# EAGLE design RHD2164-L-SS4-AmpAccel (EAGLE 9.3.2)

## Sheet 1 of 2: Vertical
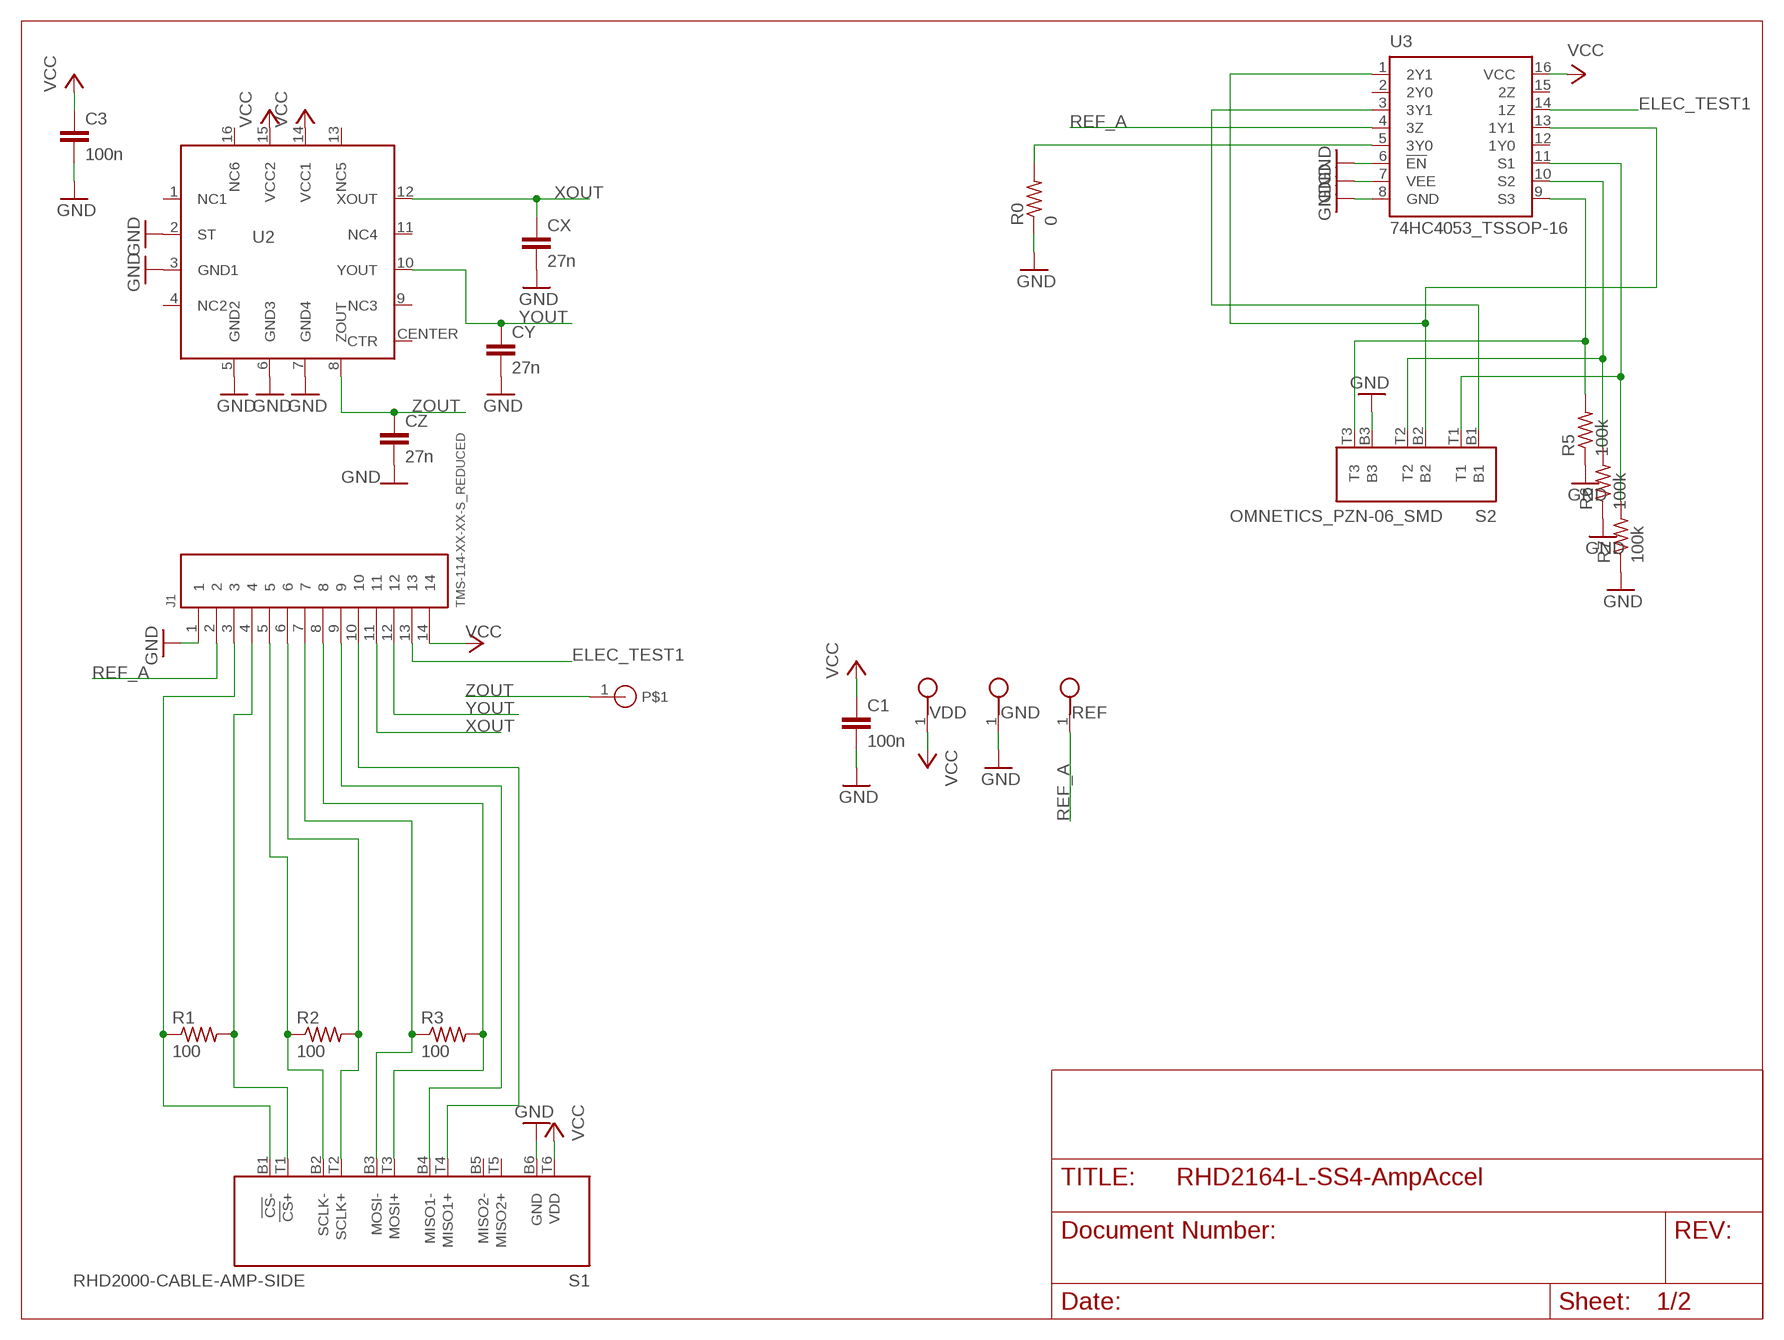
[diagram p0: schematic, sheet 1]

### Parts
C1  100n  C_0402  [0402]
C3  100n  C_0402  [0402]
CX  27n  C_0402  [0402]
CY  27n  C_0402  [0402]
CZ  27n  C_0402  [0402]
GND  TESTPOINT_SMALL  [TESTPOINT_SMALL]
J1  TMS-114-XX-XX-S_REDUCED  [TMS-114-XX-XX-S_REDUCED]
R0  0  R_0402  [0402]
R1  100  R_0201  [0201]
R2  100  R_0201  [0201]
R3  100  R_0201  [0201]
R5  100k  R_0201  [0201]
R6  100k  R_0201  [0201]
R7  100k  R_0201  [0201]
REF  TESTPOINT_SMALL  [TESTPOINT_SMALL]
S1  RHD2000-CABLE-AMP-SIDE  [OMNETICS_PZN-12-AA]
S2  OMNETICS_PZN-06_SMD  [OMNETICS_PZN-06-AA]
U2  ADXL335_IDAX  [ADXL335_IDAX]
U3  74HC4053_TSSOP-16  [TSSOP-16]
U$1  PIN_HOLE  [PIN_HOLE]
VDD  TESTPOINT_SMALL  [TESTPOINT_SMALL]

### Nets
CS-: J1.3 R1.1 S1.B1(!CS!-)
ELEC_TEST1: J1.13 U3.14(1Z)
GND [thick]: C1.2 C3.2 CX.2 CY.2 CZ.2 GND.1 J1.1 R0.1 R5.1 R6.1 R7.1 S1.B6(GND) S2.B3 U2.2(ST) U2.3(GND1) U2.5(GND2) U2.6(GND3) U2.7(GND4) U3.6(!EN!) U3.7(VEE) U3.8(GND)
N$11 [thick]: R0.2 U3.5(3Y0)
N$35: J1.4 R1.2 S1.T1(!CS!+)
N$36: J1.5 R2.1 S1.B2(SCLK-)
N$37: J1.6 R2.2 S1.T2(SCLK+)
N$38: J1.7 R3.1 S1.B3(MOSI-)
N$39: J1.8 R3.2 S1.T3(MOSI+)
N$40: J1.9 S1.B4(MISO1-)
N$81: J1.10 S1.T4(MISO1+)
N$131: R7.2 S2.T1 U3.11(S1)
N$132: R6.2 S2.T2 U3.10(S2)
N$133: R5.2 S2.T3 U3.9(S3)
N$135 [thick]: S2.B1 U3.3(3Y1)
N$136: S2.B2 U3.1(2Y1) U3.13(1Y1)
REF_A: J1.2 REF.1 U3.4(3Z)
VCC [thick]: C1.1 C3.1 J1.14 S1.T6(VDD) U2.14(VCC1) U2.15(VCC2) U3.16(VCC) VDD.1
XOUT: CX.1 J1.11 U2.12(XOUT)
YOUT: CY.1 J1.12 U2.10(YOUT)
ZOUT: CZ.1 U2.8(ZOUT) U$1.1
Unconnected: S1.B5(MISO2-) S1.T5(MISO2+) U2.1(NC1) U2.4(NC2) U2.9(NC3) U2.11(NC4) U2.13(NC5) U2.16(NC6) U2.CENTER(CTR) U3.2(2Y0) U3.12(1Y0) U3.15(2Z)

## Sheet 2 of 2: Horizontal
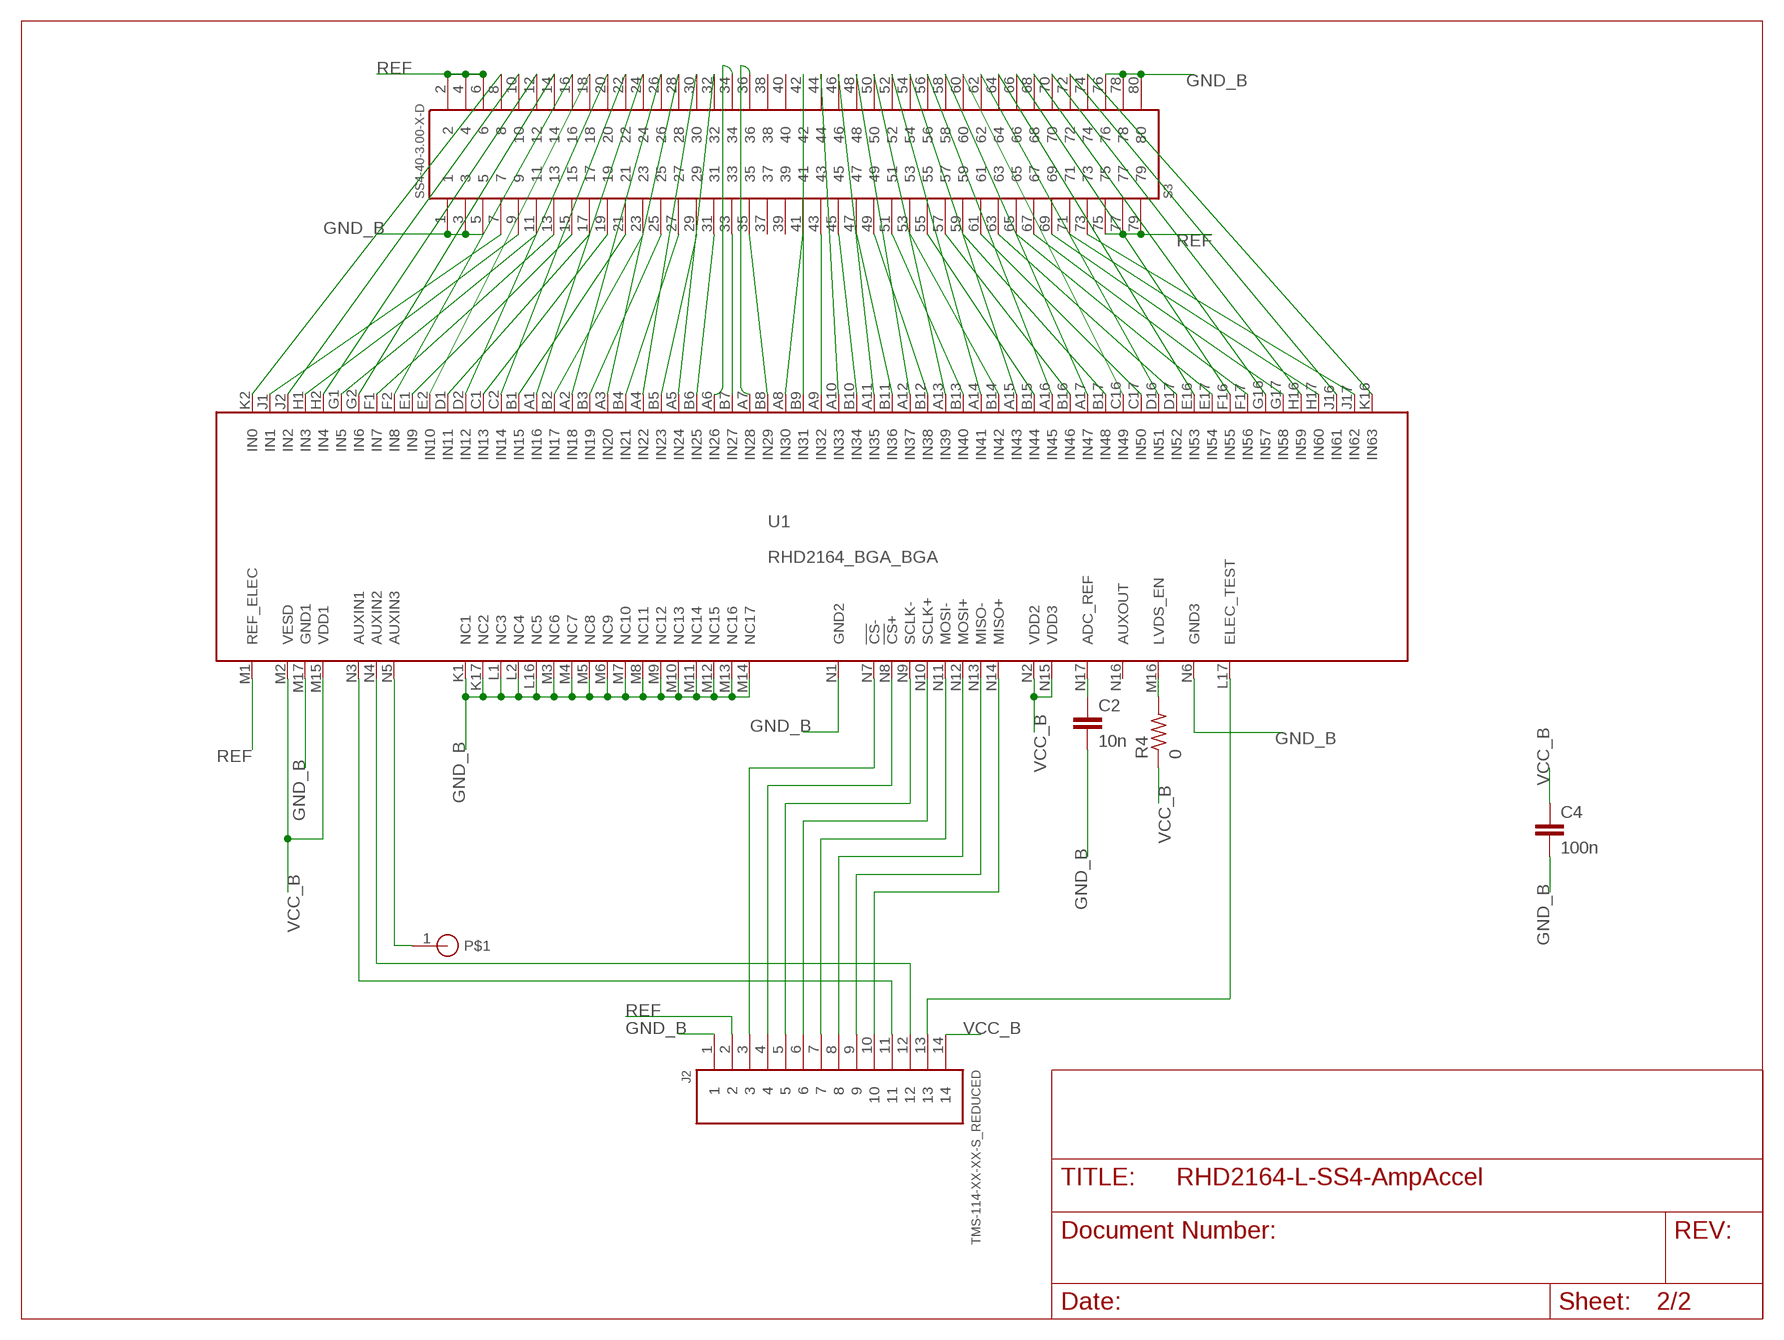
[diagram p1: schematic, sheet 2]

### Parts
C2  10n  C_0201  [0201]
C4  100n  C_0402  [0402]
J2  TMS-114-XX-XX-S_REDUCED  [TMS-114-XX-XX-S_REDUCED]
R4  0  R_0402  [0402]
S3  SS4-40-3.00-X-D  [SS4-40-3.00-X-D]
U1  RHD2164_BGA_BGA  [BGA104_9X7]
U$2  PIN_HOLE  [PIN_HOLE]

### Nets
GND_B [thick]: C2.2 C4.2 J2.1 S3.1 S3.3 S3.5 S3.76 S3.78 S3.80 U1.K1(NC1) U1.K17(NC2) U1.L1(NC3) U1.L2(NC4) U1.L16(NC5) U1.M3(NC6) U1.M4(NC7) U1.M5(NC8) U1.M6(NC9) U1.M7(NC10) U1.M8(NC11) U1.M9(NC12) U1.M10(NC13) U1.M11(NC14) U1.M12(NC15) U1.M13(NC16) U1.M14(NC17) U1.M17(GND1) U1.N1(GND2) U1.N6(GND3)
N$1: C2.1 U1.N17(ADC_REF)
N$2: S3.8 U1.K2(IN0)
N$3: S3.7 U1.J1(IN1)
N$4: S3.10 U1.J2(IN2)
N$5: S3.9 U1.H1(IN3)
N$6: S3.12 U1.H2(IN4)
N$7: S3.11 U1.G1(IN5)
N$8: S3.14 U1.G2(IN6)
N$9: S3.13 U1.F1(IN7)
N$10: J2.4 U1.N8(!CS!+)
N$13: J2.6 U1.N10(SCLK+)
N$15: J2.8 U1.N12(MOSI+)
N$16: J2.9 U1.N13(MISO-)
N$17: J2.10 U1.N14(MISO+)
N$18: S3.16 U1.F2(IN8)
N$19: S3.15 U1.E1(IN9)
N$20: S3.18 U1.E2(IN10)
N$21: S3.17 U1.D1(IN11)
N$22: S3.20 U1.D2(IN12)
N$23: S3.19 U1.C1(IN13)
N$24: S3.22 U1.C2(IN14)
N$25: S3.21 U1.B1(IN15)
N$26: S3.24 U1.A1(IN16)
N$27: S3.23 U1.B2(IN17)
N$28: S3.26 U1.A2(IN18)
N$29: S3.25 U1.B3(IN19)
N$30: S3.74 U1.K16(IN63)
N$31: S3.73 U1.J17(IN62)
N$32: S3.72 U1.J16(IN61)
N$33: S3.71 U1.H17(IN60)
N$34: S3.70 U1.H16(IN59)
N$41: S3.69 U1.G17(IN58)
N$42: R4.2 U1.M16(LVDS_EN)
N$43: S3.68 U1.G16(IN57)
N$44: S3.67 U1.F17(IN56)
N$45: S3.66 U1.F16(IN55)
N$46: S3.65 U1.E17(IN54)
N$47: S3.64 U1.E16(IN53)
N$48: S3.63 U1.D17(IN52)
N$49: S3.62 U1.D16(IN51)
N$50: S3.61 U1.C17(IN50)
N$51: S3.60 U1.C16(IN49)
N$52: S3.59 U1.B17(IN48)
N$53: S3.58 U1.A17(IN47)
N$54: S3.57 U1.B16(IN46)
N$55: S3.56 U1.A16(IN45)
N$56: S3.55 U1.B15(IN44)
N$57: S3.54 U1.A15(IN43)
N$58: S3.53 U1.B14(IN42)
N$59: S3.52 U1.A14(IN41)
N$60: S3.51 U1.B13(IN40)
N$61: S3.28 U1.A3(IN20)
N$62: S3.27 U1.B4(IN21)
N$63: S3.30 U1.A4(IN22)
N$64: S3.29 U1.B5(IN23)
N$65: S3.32 U1.A5(IN24)
N$66: S3.31 U1.B6(IN25)
N$67: S3.34 U1.A6(IN26)
N$68: S3.33 U1.B7(IN27)
N$69: S3.50 U1.A13(IN39)
N$70: S3.49 U1.B12(IN38)
N$71: S3.48 U1.A12(IN37)
N$72: S3.47 U1.B11(IN36)
N$73: S3.46 U1.A11(IN35)
N$74: S3.45 U1.B10(IN34)
N$75: S3.44 U1.A10(IN33)
N$76: S3.43 U1.A9(IN32)
N$77: S3.42 U1.B9(IN31)
N$78: S3.41 U1.A8(IN30)
N$79: S3.36 U1.A7(IN28)
N$80: S3.35 U1.B8(IN29)
N$82: J2.13 U1.L17(ELEC_TEST)
N$83: J2.11 U1.N3(AUXIN1)
N$84: J2.12 U1.N4(AUXIN2)
N$85: U1.N5(AUXIN3) U$2.1
N$86: J2.3 U1.N7(!CS!-)
N$87: J2.5 U1.N9(SCLK-)
N$88: J2.7 U1.N11(MOSI-)
REF [thick]: J2.2 S3.2 S3.4 S3.6 S3.75 S3.77 S3.79 U1.M1(REF_ELEC)
VCC_B: C4.1 J2.14 R4.1 U1.M2(VESD) U1.M15(VDD1) U1.N2(VDD2) U1.N15(VDD3)
Unconnected: S3.37 S3.38 S3.39 S3.40 U1.N16(AUXOUT)

## Library data of the parts
C1-C4 CX CY CZ = RHD2000_eval_board:C: Capacitor
GND REF VDD = RHD2000_eval_board:TESTPOINT: PCB Test Point
J1 J2 = TMS-108+114-XX-XX-S:TMS-114-XX-XX-S_REDUCED: 050" x .100" .018" Square Post Terminal Strip.
R0 R1-R7 = RHD2000_eval_board:R: Resistor
S1 = RHD2000:RHD2000-CABLE-AMP-SIDE: Omnetics A79623 PZN-12-AA connector for SPI interface (amplifier side)
S2 = RHD2000:OMNETICS_PZN-06
S3 = SS4-40-3.00-X-D_custom:SS4-40-3.00-X-D: 0.4MM SOCKET STRIP ASSEMBLY
U1 = INTAN:RHD2164_BGA: Intan Technologies RHD2164 chip, BGA package (9x7mm 104-pin)
U2 = harrison:ADXL335
U3 = harrison:74HC4053
U$1 U$2 = Various:PIN_HOLE

## Net classes
1 thick: width 0.102 mm
2 power: width 0.61 mm

## Board
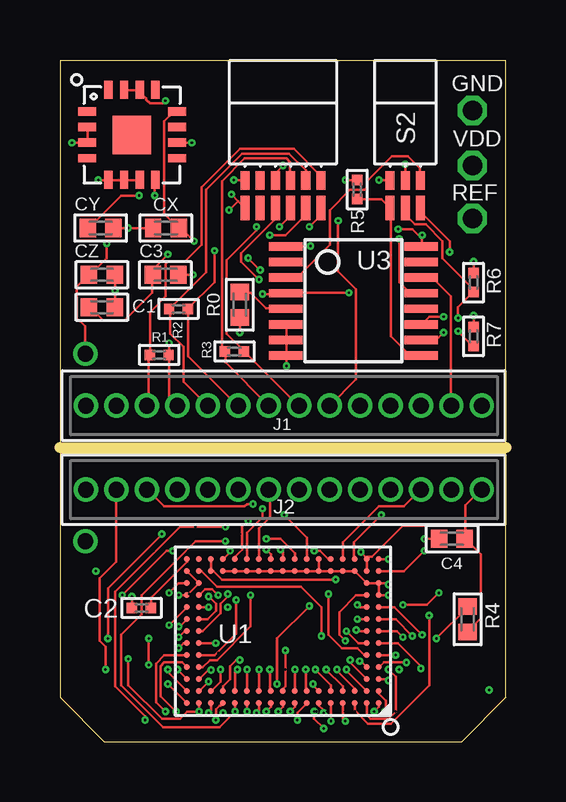
[diagram p2: board, top side]
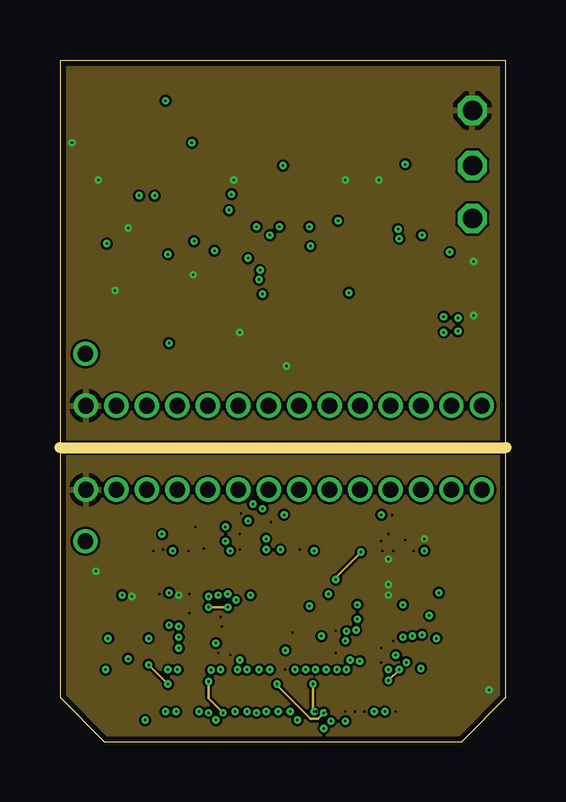
[diagram p3: board, inner layer Route2]
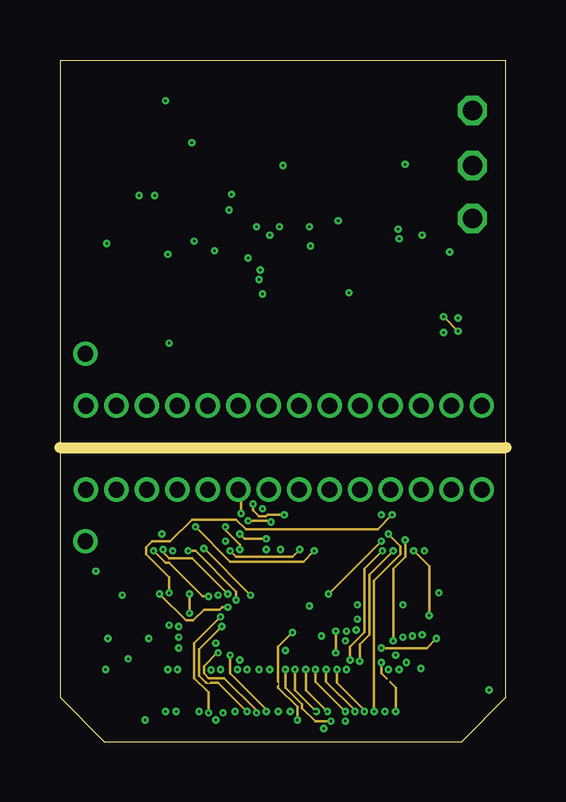
[diagram p4: board, inner layer Route15]
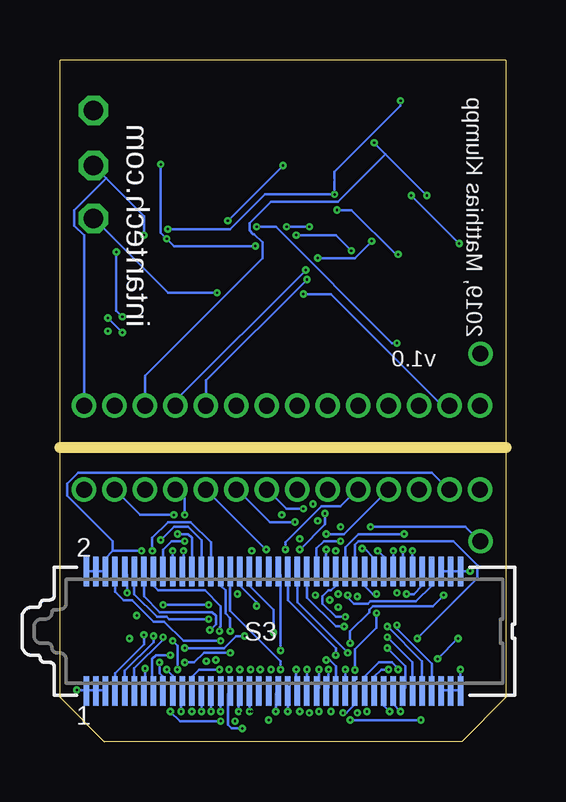
[diagram p5: board, bottom side, seen from below]

Size 18.6 x 28.4 mm. Coordinates in mm from the lower left corner, seen from the top.
Outline: 18.6,1.85 18.6,28.4 0,28.4 0,1.85 1.85,0 16.75,0 18.6,1.85
Copper layers ([2:1+2*15+16:15]): Top 0.018mm / dielectric 0.082mm / Route2 0.035mm / dielectric 0.6mm / Route15 0.035mm / dielectric 0.082mm / Bottom 0.018mm
Design rules "Multi-CB_4L_100um-Tracks_OL35um-IL35um *": minimum track width 0.1mm, minimum drill 0.1mm, track to track 0.1mm, track to pad 0.1mm, pad to pad 0.1mm, via to via 0.1mm, smd to smd 0mil, copper to edge 0.2mm, drill to drill 0.2mm, minimum pad ring 0.125mm, minimum via ring 0.1mm, stop-mask expansion 2mil, vias tented up to drill 0.45mm, thermal gap 0.2mm
Milling: 1 lines

### Footprints (pad centres in the part's own frame; a part is rotated, then mirrored left to right if it is on the bottom)
0402 = smd 0.686 x 0.762: 1 -0.533,0; 2 0.533,0
0201 = smd 0.432 x 0.432: 1 -0.394,0; 2 0.394,0
TESTPOINT_SMALL = drill 0.813 octagon: 1 0,0
TMS-114-XX-XX-S_REDUCED = drill 0.66 pad 1.016: 1 -7.615,0; 2 -6.345,0; 3 -5.075,0; 4 -3.805,0; 5 -2.535,0; 6 -1.265,0; 7 0.005,0; 8 1.275,0; 9 2.545,0; 10 3.815,0; 11 5.085,0; 12 6.355,0; 13 7.625,0; 14 8.895,0
OMNETICS_PZN-12-AA = smd 0.381 x 0.762: B1 1.587,-1.016; B2 0.953,-1.016; B3 0.318,-1.016; B4 -0.318,-1.016; B5 -0.953,-1.016; B6 -1.587,-1.016 | smd 0.381 x 1.016: T1 1.587,-2.159; T2 0.953,-2.159; T3 0.318,-2.159; T4 -0.318,-2.159; T5 -0.953,-2.159; T6 -1.587,-2.159
OMNETICS_PZN-06-AA = smd 0.381 x 0.762: B1 0.635,-1.016; B2 0,-1.016; B3 -0.635,-1.016 | smd 0.381 x 1.016: T1 0.635,-2.159; T2 0,-2.159; T3 -0.635,-2.159
SS4-40-3.00-X-D = smd 0.23 x 1.23: 1 7.8,2.485; 2 7.8,-2.485; 3 7.4,2.485; 4 7.4,-2.485; 5 7,2.485; 6 7,-2.485; 7 6.6,2.485; 8 6.6,-2.485; 9 6.2,2.485; 10 6.2,-2.485; 11 5.8,2.485; 12 5.8,-2.485; 13 5.4,2.485; 14 5.4,-2.485; 15 5,2.485; 16 5,-2.485; 17 4.6,2.485; 18 4.6,-2.485; 19 4.2,2.485; 20 4.2,-2.485; 21 3.8,2.485; 22 3.8,-2.485; 23 3.4,2.485; 24 3.4,-2.485; 25 3,2.485; 26 3,-2.485; 27 2.6,2.485; 28 2.6,-2.485; 29 2.2,2.485; 30 2.2,-2.485; 31 1.8,2.485; 32 1.8,-2.485; 33 1.4,2.485; 34 1.4,-2.485; 35 1,2.485; 36 1,-2.485; 37 0.6,2.485; 38 0.6,-2.485; 39 0.2,2.485; 40 0.2,-2.485; 41 -0.2,2.485; 42 -0.2,-2.485; 43 -0.6,2.485; 44 -0.6,-2.485; 45 -1,2.485; 46 -1,-2.485; 47 -1.4,2.485; 48 -1.4,-2.485; 49 -1.8,2.485; 50 -1.8,-2.485; 51 -2.2,2.485; 52 -2.2,-2.485; 53 -2.6,2.485; 54 -2.6,-2.485; 55 -3,2.485; 56 -3,-2.485; 57 -3.4,2.485; 58 -3.4,-2.485; 59 -3.8,2.485; 60 -3.8,-2.485; 61 -4.2,2.485; 62 -4.2,-2.485; 63 -4.6,2.485; 64 -4.6,-2.485; 65 -5,2.485; 66 -5,-2.485; 67 -5.4,2.485; 68 -5.4,-2.485; 69 -5.8,2.485; 70 -5.8,-2.485; 71 -6.2,2.485; 72 -6.2,-2.485; 73 -6.6,2.485; 74 -6.6,-2.485; 75 -7,2.485; 76 -7,-2.485; 77 -7.4,2.485; 78 -7.4,-2.485; 79 -7.8,2.485; 80 -7.8,-2.485
BGA104_9X7 = smd 0.25 x 0.25: A1 -4,3; A2 -3.5,3; A3 -3,3; A4 -2.5,3; A5 -2,3; A6 -1.5,3; A7 -1,3; A8 -0.5,3; A9 0,3; A10 0.5,3; A11 1,3; A12 1.5,3; A13 2,3; A14 2.5,3; A15 3,3; A16 3.5,3; A17 4,3; B1 -4,2.5; B2 -3.5,2.5; B3 -3,2.5; B4 -2.5,2.5; B5 -2,2.5; B6 -1.5,2.5; B7 -1,2.5; B8 -0.5,2.5; B9 0,2.5; B10 0.5,2.5; B11 1,2.5; B12 1.5,2.5; B13 2,2.5; B14 2.5,2.5; B15 3,2.5; B16 3.5,2.5; B17 4,2.5; C1 -4,2; C2 -3.5,2; C16 3.5,2; C17 4,2; D1 -4,1.5; D2 -3.5,1.5; D16 3.5,1.5; D17 4,1.5; E1 -4,1; E2 -3.5,1; E16 3.5,1; E17 4,1; F1 -4,0.5; F2 -3.5,0.5; F16 3.5,0.5; F17 4,0.5; G1 -4,0; G2 -3.5,0; G16 3.5,0; G17 4,0; H1 -4,-0.5; H2 -3.5,-0.5; H16 3.5,-0.5; H17 4,-0.5; J1 -4,-1; J2 -3.5,-1; J16 3.5,-1; J17 4,-1; K1 -4,-1.5; K2 -3.5,-1.5; K16 3.5,-1.5; K17 4,-1.5; L1 -4,-2; L2 -3.5,-2; L16 3.5,-2; L17 4,-2; M1 -4,-2.5; M2 -3.5,-2.5; M3 -3,-2.5; M4 -2.5,-2.5; M5 -2,-2.5; M6 -1.5,-2.5; M7 -1,-2.5; M8 -0.5,-2.5; M9 0,-2.5; M10 0.5,-2.5; M11 1,-2.5; M12 1.5,-2.5; M13 2,-2.5; M14 2.5,-2.5; M15 3,-2.5; M16 3.5,-2.5; M17 4,-2.5; N1 -4,-3; N2 -3.5,-3; N3 -3,-3; N4 -2.5,-3; N5 -2,-3; N6 -1.5,-3; N7 -1,-3; N8 -0.5,-3; N9 0,-3; N10 0.5,-3; N11 1,-3; N12 1.5,-3; N13 2,-3; N14 2.5,-3; N15 3,-3; N16 3.5,-3; N17 4,-3
ADXL335_IDAX = smd 0.75 x 0.35: 1 -1.875,0.975; 2 -1.875,0.325; 3 -1.875,-0.325; 4 -1.875,-0.975; 9 1.875,-0.975; 10 1.875,-0.325; 11 1.875,0.325; 12 1.875,0.975 | smd 0.35 x 0.75: 5 -0.975,-1.875; 6 -0.325,-1.875; 7 0.325,-1.875; 8 0.975,-1.875; 13 0.975,1.875; 14 0.325,1.875; 15 -0.325,1.875; 16 -0.975,1.875 | smd 1.6 x 1.6: CENTER 0,0
TSSOP-16 = smd 0.348 x 1.397: 1 -2.273,-2.814; 2 -1.623,-2.815; 3 -0.973,-2.815; 4 -0.323,-2.815; 5 0.327,-2.815; 6 0.977,-2.815; 7 1.627,-2.815; 8 2.277,-2.815; 9 2.277,2.825; 10 1.627,2.825; 11 0.977,2.825; 12 0.327,2.825; 13 -0.323,2.825; 14 -0.973,2.825; 15 -1.623,2.825; 16 -2.273,2.825
PIN_HOLE = drill 0.66 pad 1.016: 1 0.015,0

### Placement (x,y rotation side)
C1  1.75,18.1 0 top
C2  3.4,5.57 180 top
C3  4.4,19.45 0 top
C4  16.35,8.45 180 top
CX  4.42,21.4 180 top
CY  1.7,21.4 0 top
CZ  1.75,19.45 0 top
GND  17.2,26.3 0 top
J1  8.7,14 0 top
J2  8.7,10.5 0 top
R0  7.5,18.2 90 top
R1  4.14,16.11 0 top
R2  4.95,18.03 0 top
R3  7.27,16.26 0 top
R4  17,5.1 90 top
R5  12.4,23 270 top
R6  17.24,19.13 270 top
R7  17.24,16.88 270 top
REF  17.2,21.8 0 top
S1  9.3,24.4 0 top
S2  14.4,24.4 0 top
S3  9.7,4.6 180 bottom
U1  9.3,4.6 180 top
U2  3,25.28 0 top
U3  12.24,18.36 270 top
U$1  1.05,16.16 0 top
U$2  1.05,8.35 0 top
VDD  17.2,24 0 top

### Tracks (layer width: path | path; a pad name or v marks a point on that pad's centre or on a via)
CS-
  Top 0.1: J1.3 3.65,14 3.7,14.05 3.7,16.1 R1.1 3.75,16.15 3.75,17.9 4.4,18.55 4.4,19.9 4.5,20 5.2,20 5.9,20.7 5.9,23.1 7.5,24.7 9.75,24.7 10.85,23.6 10.85,23.4 S1.B1
ELEC_TEST1
  Top 0.1: U3.14 15.1,19.3 15.55,19.3 16.3,18.55 16.3,14 J1.13
GND  (via drill 0.1 layers 1-2)
  Top 0.102: U3.6 9.45,17.35 9.45,16.75 U3.7 9.45,16.7 9.45,16.1 U3.8 9.45,16.05 v9.45,15.65 | C1.2 2.3,18.1 v2.3,18.8 2.3,19.45 CZ.2 | U2.7 3.3,23.4 2.7,23.4 U2.6 2.65,23.4 2.05,23.4 U2.5 2,23.4 v1.6,23.4 | U2.2 1.15,25.6 1.15,25 U2.3 1.1,24.95 v0.5,24.95 | v17.25,17.75 17.25,17.3 R7.1 | v17.25,20 17.25,19.55 R6.1 | v11.9,23.4 R5.1 | v5.55,19.45 C3.2 | CY.2 v2.85,21.4 CX.2 | v7.5,17.05 R0.1 | v7.25,23.4 7.7,23.4 S1.B6 | v13.3,23.4 13.75,23.4 S2.B3
  pour Route2: 0.1,12.6 0.1,28.3 18.5,28.3 18.5,12.6
GND_B  (via drill 0.1, 0.1 layers 1-2)
  Top 0.102: U1.M14 U1.M13 U1.M12 U1.M11 U1.M10 U1.M9 U1.M8 U1.M7 U1.M6 | U1.M6 U1.M5 U1.M4 U1.M3 | U1.M6 U1.N6 | U1.M17 U1.L16 U1.K17 v4.95,6.1 | U1.L1 U1.L2 | U1.L1 U1.K1 v13.7,6.1 | 13.3,6.65 U1.L1 | v3,6.05 3,5.6 C2.2 | v15.2,8.45 C4.2 | 12.35,7.1 U1.M3 | 12.8,6.65 U1.L2 | v13.7,7.6 U1.N1 | v13.7,6.55 13.65,6.6 U1.L1 | U1.M3 U1.L2
  Bottom 0.102: S3.5 16.7,2.15 17.1,2.15 S3.3 17.15,2.15 17.5,2.15 S3.1 17.55,2.15 v17.9,2.15 | S3.76 2.7,7.1 2.35,7.1 S3.78 2.3,7.1 1.9,7.1 S3.80 1.85,7.1 v1.5,7.1
  pour Route2: 0.1,11.9 0.1,1.9 1.9,0.1 16.7,0.1 18.5,1.9 18.5,11.9
N$1
  Top 0.1: U1.N17 5.3,7.5 3.8,6 3.8,5.6 C2.1
N$2  (via drill 0.1)
  Top 0.1: U1.K2 12.35,6.1 11.65,5.4 11.65,4.45 v11.9,4.2
  Bottom 0.1: v11.9,4.2 13.45,4.2 14.25,5 14.7,5 15.6,5.9 15.95,5.9 16.3,6.25 S3.8
N$3  (via drill 0.1)
  Top 0.1: U1.J1 13.95,5.6 v15.1,4.45
  Bottom 0.1: v15.1,4.45 15.1,4.05 16.3,2.85 S3.7
N$4  (via drill 0.1)
  Top 0.1: U1.J2 12.5,5.6 v12.4,5.7 | v14.3,5.7 15.3,5.7 v15.8,6.2
  Bottom 0.1: v14.3,5.7 v12.4,5.7 | v15.8,6.2 15.8,6.95 15.9,7.05 S3.10
N$5  (via drill 0.1)
  Top 0.1: U1.H1 14,5.1 v14.7,4.4
  Bottom 0.1: v14.7,4.4 14.7,4.15 15.9,2.95 S3.9
N$6  (via drill 0.1)
  Top 0.1: v12.4,5.1 U1.H2
  Bottom 0.1: v12.4,5.1 14.05,5.1 14.15,5.2 14.55,5.2 15.5,6.15 S3.12
N$7  (via drill 0.1)
  Top 0.1: U1.G1 14.05,4.6 v14.3,4.35
  Bottom 0.1: v14.3,4.35 14.3,4.25 15.5,3.05 S3.11
N$8  (via drill 0.1)
  Top 0.1: U1.G2 12.4,4.6 v12.35,4.65
  Bottom 0.1: v12.35,4.65 12.1,4.9 12.1,5.25 12.25,5.4 14.45,5.4 15.1,6.05 S3.14
N$9  (via drill 0.1)
  Top 0.1: U1.F1 14.1,4.1 15.05,3.15 v15.05,3.05
  Bottom 0.1: v15.05,3.05 15.05,2.2 15.1,2.15 S3.13
N$10  (via drill 0.1, 0.1 layers 15-16)
  Top 0.1: U1.N8 9.8,7.85 9.2,8.45 v8.6,8.45
  Route15 0.1: v8.6,8.45 7.7,8.45 v7.5,8.65
  Bottom 0.1: v7.5,8.65 6.75,8.65 J2.4
N$11
  Top 0.102: R0.2 7.5,18.7 7.95,18.7 8.6,18.05 9.4,18.05 U3.5
N$13  (via drill 0.1, 0.1 layers 15-16)
  Top 0.1: U1.N10 8.8,7.8 v8.6,8
  Route15 0.1: v7.55,9.5 7.55,10.4 7.45,10.5 J2.6
  Bottom 0.1: v8.6,8 7.55,9.05 v7.55,9.5
N$15  (via drill 0.1)
  Top 0.1: U1.N12 7.8,8.7 8.45,9.35 v8.45,9.7
  Bottom 0.1: v8.45,9.7 9.15,9.7 9.95,10.5 J2.8
N$16  (via drill 0.1, 0.1 layers 15-16)
  Top 0.1: U1.N13 7.3,7.7 7.6,8 7.6,8.95 v7.85,9.2
  Route15 0.1: v7.85,9.2 8.75,9.2 v8.8,9.15
  Bottom 0.1: v8.8,9.15 9.85,9.15 11.2,10.5 J2.9
N$17  (via drill 0.1, 0.1 layers 15-16)
  Top 0.1: U1.N14 7.1,7.9 v7.1,7.95
  Route15 0.1: v7.1,7.95 7.35,7.7 9.7,7.7 v10,8
  Bottom 0.1: v10,8 J2.10
N$18  (via drill 0.1)
  Top 0.1: U1.F2 12.45,4.1 v11.95,4.6
  Bottom 0.1: v11.95,4.6 11.95,4.75 11.9,4.8 11.9,5.65 12.55,6.3 14.5,6.3 14.7,6.5 S3.16
N$19  (via drill 0.1)
  Top 0.1: v14,3.6 U1.E1
  Bottom 0.1: v14,3.6 14.6,3.6 14.75,3.45 14.75,2.2 14.7,2.15 S3.15
N$20  (via drill 0.1, 0.1 layers 15-16)
  Top 0.1: U1.E2 12.7,3.6 12.4,3.9 11.75,3.9 11.2,4.45 v11.2,6.15
  Route15 0.1: v13.4,8.35 v11.2,6.15
  Bottom 0.1: v13.4,8.35 13.95,8.35 14.3,8 S3.18
N$21  (via drill 0.1)
  Top 0.1: U1.D1 13.5,3.3 v14.45,3.3
  Bottom 0.1: v14.45,3.3 14.45,2.85 14.3,2.7 S3.17
N$22  (via drill 0.1, 0.1 layers 15-16)
  Top 0.1: U1.D2 12.55,3.35 v12.5,3.35
  Route15 0.1: v12.5,3.35 12.5,4.05 12.9,4.45 12.9,6.95 v13.9,7.95
  Bottom 0.1: S3.20 v13.9,7.95
N$23  (via drill 0.1, 0.1 layers 1-2)
  Top 0.1: U1.C1 13.65,2.6 v13.7,2.55
  Route2 0.1: v14.15,3 v13.7,2.55
  Bottom 0.1: v14.15,3 13.9,2.75 S3.19
N$24  (via drill 0.1, 0.1 layers 15-16)
  Top 0.1: U1.C2 12.1,3.3 v12.1,3.4
  Route15 0.1: v12.1,3.4 12.1,3.95 12.7,4.55 12.7,7.2 v13.45,7.95
  Bottom 0.1: v13.45,7.95 13.45,7.15 13.5,7.1 S3.22
N$25  (via drill 0.1)
  Top 0.1: U1.B1 13.3,2 13.6,1.7 13.6,1.3 v13.55,1.25
  Bottom 0.1: v13.55,1.25 13.55,2.05 S3.21
N$26  (via drill 0.1, 0.1 layers 15-16)
  Top 0.1: U1.A1 13.3,1.45 v13.1,1.25
  Route15 0.1: v13.1,1.25 13.1,6.7 14.2,7.8 14.2,8.15 v13.7,8.65
  Bottom 0.1: v13.7,8.65 13.25,8.65 13.1,8.5 S3.24
N$27  (via drill 0.1)
  Top 0.1: U1.B2 11.95,2.95 v11.95,3
  Bottom 0.1: v11.95,3 12.8,3 13.1,2.7 S3.23
N$28  (via drill 0.1, 0.1 layers 15-16)
  Top 0.1: U1.A2 12.8,1.1 12.95,0.95 13.7,0.95 14,1.25 14,2.7 v13.7,3
  Route15 0.1: v13.9,4.2 13.9,7.2 14.4,7.7 v14.4,8.4
  Bottom 0.1: v13.7,3 13.7,4 v13.9,4.2 | v14.4,8.4 13.85,8.95 13.25,8.95 12.7,8.4 S3.26
N$29  (via drill 0.1, 0.1 layers 15-16)
  Top 0.1: U1.B3 12.3,2.2 11.55,2.95 v11.55,3
  Route15 0.1: v11.55,3 11.55,2.45 12.7,1.3 v12.7,1.25
  Bottom 0.1: S3.25 v12.7,1.25
N$30  (via drill 0.1)
  Top 0.1: U1.K16 6.05,6.35 6.35,6.35 v6.6,6.1
  Bottom 0.1: v6.6,6.1 6.6,6 6.35,5.75 5.75,5.75 5.65,5.85 3.75,5.85 3.1,6.5 S3.74
N$31  (via drill 0.1)
  Top 0.1: v4.55,4.85 U1.J17
  Bottom 0.1: v4.55,4.85 4.55,4.7 3.1,3.25 S3.73
N$32  (via drill 0.1, 0.1 layers 1-2, 0.1 layers 15-16)
  Top 0.1: v6.2,5.6 U1.J16
  Route2 0.1: v7,5.6 v6.2,5.6
  Route15 0.1: v7,5.6 6.75,5.6 6.65,5.5 6,5.5 5.55,5.05 5.25,5.05 v4.15,6.15
  Bottom 0.1: v4.15,6.15 3.85,6.15 3.5,6.5 S3.72
N$33  (via drill 0.1)
  Top 0.1: U1.H17 5,4.8 v4.95,4.8
  Bottom 0.1: v4.95,4.8 3.5,3.35 S3.71
N$34  (via drill 0.1, 0.1 layers 15-16)
  Top 0.1: U1.H16 6.15,5.1 6.5,5.45 6.5,5.75 v6.2,6.05
  Route15 0.1: v6.2,6.05 5.95,6.05 4.55,7.45 4.4,7.45 v3.9,7.95
  Bottom 0.1: S3.70 v3.9,7.95
N$35  (via drill 0.1)
  Top 0.1: J1.4 4.85,14 4.55,14.3 4.55,16.1 R1.2 4.55,16.15 v4.55,16.6 | v10.4,21.45 10.85,21.9 10.85,22.2 S1.T1
  Bottom 0.1: v10.4,21.45 9.6,21.45 4.75,16.6 v4.55,16.6
N$36
  Top 0.1: J1.5 5.15,15 5.15,16.45 4.6,17 4.6,18 R2.1 4.6,18.05 6.1,19.55 6.1,23 7.6,24.5 9.55,24.5 10.25,23.8 10.25,23.4 S1.B2
N$37  (via drill 0.1)
  Top 0.1: J1.6 7.4,14 5.35,16.05 5.35,18 R2.2 5.35,18.05 6.45,19.15 v6.45,20.45 | v8.75,21.1 9.4,21.1 10.25,21.95 10.25,22.2 S1.T2
  Bottom 0.1: v8.75,21.1 7.1,21.1 v6.45,20.45
N$38
  Top 0.1: J1.7 6.9,15.8 6.9,16.25 R3.1 6.85,16.3 6.75,16.4 6.75,23.35 7.7,24.3 9.45,24.3 9.6,24.15 9.6,23.4 S1.B3
N$39  (via drill 0.1)
  Top 0.1: J1.8 9.95,14 7.7,16.25 R3.2 7.65,16.3 6.95,17 6.95,20.05 8.2,21.3 v8.2,21.45 | v9.15,21.45 9.6,21.9 9.6,22.2 S1.T3
  Bottom 0.1: v8.2,21.45 v9.15,21.45
N$40  (via drill 0.1)
  Top 0.1: v9.3,24 9,23.7 9,23.4 S1.B4 | v11.6,21.7 11.6,19.6 12.35,18.85 12.35,15.1 J1.9
  Bottom 0.1: v11.6,21.7 v9.3,24
N$41  (via drill 0.1)
  Top 0.1: U1.G17 5.2,4.6 v4.95,4.35
  Bottom 0.1: v4.95,4.35 3.9,3.3 S3.69
N$42  (via drill 0.1, 0.1 layers 15-16)
  Top 0.1: U1.M16 5.9,7.1 6.55,6.45 10.05,6.45 10.9,5.6 v10.9,4.4 | v15.7,4.3 17,5.6 R4.2
  Route15 0.1: v13.4,3.9 15.3,3.9 v15.7,4.3
  Bottom 0.1: v10.9,4.4 11.25,4.4 11.75,3.9 v13.4,3.9
N$43  (via drill 0.1, 0.1 layers 15-16)
  Top 0.1: U1.G16 5.95,4.6 6.7,5.35 6.7,5.75 7,6.05 v7,6.15
  Route15 0.1: v7,6.15 5.5,7.65 4.55,7.65 4.3,7.9 v4.3,8
  Bottom 0.1: S3.68 v4.3,8
N$44  (via drill 0.1)
  Top 0.1: U1.F17 5.15,4.1 v4.95,3.9
  Bottom 0.1: v4.95,3.9 4.2,3.15 4.2,2.25 4.3,2.15 S3.67
N$45  (via drill 0.1)
  Top 0.1: v6.5,4.1 U1.F16 | v2.6,6.1 4.45,7.95 v4.7,7.95
  Bottom 0.1: v6.5,4.1 6.5,4.6 5.7,5.4 5.7,5.5 5.55,5.65 3.05,5.65 v2.6,6.1 | S3.66 v4.7,7.95
N$46  (via drill 0.1)
  Top 0.1: U1.E17 4.35,3.6 4,3.25 4,1.65 v4.4,1.25
  Bottom 0.1: v4.4,1.25 4.7,1.55 S3.65
N$47  (via drill 0.1, 0.1 layers 15-16)
  Top 0.1: U1.E16 6.45,3.6 7.35,4.5 v7.35,5.9
  Route15 0.1: v7.35,5.9 7.35,6.25 5.65,7.95 v5.35,7.95
  Bottom 0.1: v5.35,7.95 5.1,7.7 S3.64
N$48  (via drill 0.1)
  Top 0.1: U1.D17 5.1,3.3 4.35,3.3 4.2,3.15 4.2,1.9 v4.85,1.25
  Bottom 0.1: v4.85,1.25 5.1,1.5 S3.63
N$49  (via drill 0.1, 0.1 layers 15-16)
  Top 0.1: U1.D16 5.95,3.1 6.25,3.4 6.55,3.4 7.95,4.8 v7.95,6.1
  Route15 0.1: v6,8.05 v7.95,6.1
  Bottom 0.1: v6,8.05 5.9,8.05 5.5,7.65 S3.62
N$50  (via drill 0.1)
  Top 0.1: v4.9,3 U1.C17
  Bottom 0.1: v4.9,3 5.2,3 5.5,2.7 S3.61
N$51  (via drill 0.1, 0.1 layers 15-16)
  Top 0.1: U1.C16 6.18,2.98 v6.3,2.98
  Route15 0.1: v5.4,6.15 v5.4,5.35
  Bottom 0.1: v6.3,2.98 6.3,3.85 5.4,4.75 v5.4,5.35 | v5.4,6.15 5.55,6.15 5.9,6.5 S3.60
N$52  (via drill 0.1)
  Top 0.1: U1.B17 4.5,2.9 v4.5,3
  Bottom 0.1: v4.5,3 4.6,3.1 4.6,3.15 4.75,3.3 5.3,3.3 5.9,2.7 S3.59
N$53  (via drill 0.1, 0.1 layers 1-2)
  Top 0.1: v4.5,2.4 U1.A17 | v3.7,4.3 v3.7,3.2
  Route2 0.1: v3.7,3.2 v4.5,2.4
  Bottom 0.1: v3.7,4.3 1.2,6.8 1.2,7.35 2.2,8.35 6.15,8.35 6.3,8.2 S3.58
N$54  (via drill 0.1, 0.1 layers 1-2)
  Top 0.1: v6.2,2.5 U1.B16
  Route2 0.1: v6.2,2.5 6.2,1.8 v6.8,1.2
  Bottom 0.1: v6.8,1.2 6.65,1.2 6.3,1.55 S3.57
N$55  (via drill 0.1)
  Top 0.1: U1.A16 v5.8,1.25 5.3,1.25 5,0.95 4.25,0.95 2.85,2.35 v2.85,3.45 | v2,4.3 2,6.4 v4.25,8.65
  Bottom 0.1: v2,4.3 v2.85,3.45 | v4.25,8.65 6.15,8.65 6.7,8.1 S3.56
N$56  (via drill 0.1)
  Top 0.1: U1.B15 6.7,2.5 v6.7,3
  Bottom 0.1: S3.55 v6.7,3
N$57  (via drill 0.1, 0.1 layers 15-16)
  Top 0.1: U1.A15 6.3,1.3 v6.2,1.2
  Route15 0.1: v6.2,1.2 6.2,2.05 5.6,2.65 5.6,4.1 v6.7,5.2
  Bottom 0.1: v6.7,5.2 7.1,5.2 7.65,5.75 7.65,6.05 7.4,6.3 7.3,6.3 7.1,6.5 S3.54
N$58  (via drill 0.1)
  Top 0.1: U1.B14 6.8,2.3 7.1,2.6 7.1,3.15 7.35,3.4 v7.5,3.4
  Bottom 0.1: v7.5,3.4 7.35,3.4 7.1,3.15 S3.53
N$59  (via drill 0.1, 0.1 layers 15-16)
  Top 0.1: U1.A14 6.7,1.5 6.65,1.5 6.5,1.35 v6.5,0.9 | v3.55,0.9 3.55,1.05 2.3,2.3 2.3,6.25 5,8.95 v6.9,8.95
  Route15 0.1: v6.9,8.95 6.9,8.8 7.5,8.2 v7.5,8
  Bottom 0.1: v3.55,0.9 v6.5,0.9 | S3.52 v7.5,8
N$60  (via drill 0.1)
  Top 0.1: U1.B13 7.3,2.9 v7.4,3
  Bottom 0.1: v7.4,3 7.4,2.25 7.5,2.15 S3.51
N$61  (via drill 0.1, 0.1 layers 15-16)
  Top 0.1: U1.A3 12.3,1.3 12.85,0.75 13.8,0.75 15.4,2.35 v15.4,5.25
  Route15 0.1: v15.4,5.25 15.4,7.3 v14.75,7.95
  Bottom 0.1: v14.75,7.95 14.75,8.5 14.1,9.15 13.15,9.15 12.3,8.3 S3.28
N$62  (via drill 0.1, 0.1 layers 15-16)
  Top 0.1: U1.B4 11.8,2.3 v11.1,3
  Route15 0.1: v11.1,3 11.1,2.5 12.3,1.3 v12.3,1.25
  Bottom 0.1: S3.27 v12.3,1.25
N$63  (via drill 0.1, 0.1 layers 15-16)
  Top 0.102: U1.A4 11.8,0.95 v11.9,0.85
  Route15 0.1: v14,1.25 14,2.25 13.4,2.85 v13.4,3.3 | v11.5,4.6 v11.5,3.7
  Bottom 0.1: v11.9,0.85 13.6,0.85 v14,1.25 | v13.4,3.3 13,3.3 12.6,3.7 v11.5,3.7 | v11.5,4.6 11.5,5.15 11.7,5.35 11.7,6.3 11.9,6.5 S3.30
N$64  (via drill 0.1, 0.1 layers 15-16)
  Top 0.1: U1.B5 11.3,2.35 v10.65,3
  Route15 0.1: v10.65,3 10.65,2.5 v11.9,1.25
  Bottom 0.1: S3.29 v11.9,1.25
N$65  (via drill 0.1, 0.1 layers 15-16)
  Top 0.1: U1.A5 v11.3,0.85
  Route15 0.1: v9.4,3 9.4,2.25 10.1,1.55 10.1,1.4 10.65,0.85 v11.3,0.85
  Bottom 0.1: v9.4,3 9.4,3.35 11.5,5.45 S3.32
N$66  (via drill 0.1, 0.1 layers 1-2)
  Top 0.1: U1.B6 10.55,2.35 v10.55,2.4 | v10.6,1.25 10.6,0.95 v11,0.55
  Route2 0.1: v10.55,2.4 10.55,1.3 v10.6,1.25
  Bottom 0.1: v11,0.55 11.45,0.55 11.6,0.7 11.6,2 S3.31
N$67  (via drill 0.1, 0.1 layers 1-2)
  Top 0.1: U1.A6 10.8,1.5 11,1.3 v11,1.2 | v9.05,2.4 9.05,4.3 v10.4,5.65
  Route2 0.1: v11,1.2 10.75,0.95 10.45,0.95 9.05,2.35 v9.05,2.4
  Bottom 0.1: v10.4,5.65 10.4,5.8 11.1,6.5 S3.34
N$68  (via drill 0.1, 0.1 layers 15-16)
  Top 0.1: U1.B7 10.3,2.2 10.25,2.25 v10.25,3
  Route15 0.1: v10.25,3 10.25,2.15 v11.15,1.25
  Bottom 0.1: v11.15,1.25 11.15,2.05 S3.33
N$69  (via drill 0.1)
  Top 0.1: U1.A13 v7.3,1.25 6.65,0.6 4.3,0.6 2.55,2.35 2.55,4.45 3.4,5.3 3.4,6.1 5.65,8.35 v6.9,8.35
  Bottom 0.1: v6.9,8.35 7.6,8.35 7.9,8.05 S3.50
N$70  (via drill 0.1)
  Top 0.1: v7.8,3 U1.B12
  Bottom 0.1: v7.8,3 7.8,2.25 7.9,2.15 S3.49
N$71  (via drill 0.1, 0.1 layers 15-16)
  Top 0.1: U1.A12 v7.8,1.25
  Route15 0.1: v7.8,1.25 6.6,2.45 6.1,2.45 5.8,2.75 5.8,3.85 v6.75,4.8
  Bottom 0.1: v6.75,4.8 7.1,4.8 8.3,6 S3.48
N$72  (via drill 0.1)
  Top 0.1: v8.3,3 U1.B11
  Bottom 0.1: S3.47 v8.3,3
N$73  (via drill 0.1, 0.1 layers 15-16)
  Top 0.1: U1.A11 8.3,1.3 v8.2,1.2
  Route15 0.1: v8.2,1.2 8.2,1.3 6.85,2.65 6.2,2.65 6,2.85 6,3.15 6.55,3.7 v6.6,3.7
  Bottom 0.1: v6.6,3.7 8.7,5.8 S3.46
N$74  (via drill 0.1)
  Top 0.1: U1.B10 8.8,2.2 8.75,2.25 v8.75,3
  Bottom 0.1: v8.75,3 8.75,2.2 8.7,2.15 S3.45
N$75  (via drill 0.1, 0.1 layers 15-16)
  Top 0.1: U1.A10 8.8,1.45 v8.6,1.25
  Route15 0.1: v8.6,1.25 8.6,1.35 7.1,2.85 v7.1,3.6
  Bottom 0.1: v7.1,3.6 7.1,3.9 9.1,5.9 S3.44
N$76  (via drill 0.1)
  Top 0.1: U1.A9 9.3,1.45 v9.1,1.25
  Bottom 0.1: S3.43 v9.1,1.25
N$77  (via drill 0.1)
  Top 0.1: U1.B9 9.3,2.2 9.4,2.3 v9.4,3.8
  Bottom 0.1: v9.4,3.8 9.4,6.95 9.5,7.05 S3.42
N$78  (via drill 0.1)
  Top 0.1: U1.A8 9.8,1.45 v9.6,1.25
  Bottom 0.1: v9.6,1.25 9.6,2 S3.41
N$79  (via drill 0.1, 0.1 layers 15-16)
  Top 0.1: U1.A7 9.9,1.2 v9.9,0.9
  Route15 0.1: v9.9,0.9 9.9,1.45 9.1,2.25 9.1,3.95 v9.7,4.55
  Bottom 0.1: v9.7,4.55 9.7,5.5 10.7,6.5 S3.36
N$80  (via drill 0.1, 0.1 layers 15-16)
  Top 0.1: v9.8,3 U1.B8
  Route15 0.1: v9.8,3 9.8,2.15 v10.7,1.25
  Bottom 0.1: S3.35 v10.7,1.25
N$81  (via drill 0.1)
  Top 0.1: v8.3,19.25 7.55,20 7.55,20.35 8.95,21.75 8.95,22.2 S1.T4
  Bottom 0.1: v8.3,19.25 12.5,15.05 J1.10
N$82  (via drill 0.1, 0.1 layers 15-16)
  Top 0.1: U1.L17 4.95,6.6 v4.55,6.2
  Route15 0.1: v4.55,6.2 4.55,6.85 3.6,7.8 3.6,8.1 3.85,8.35 4.6,8.35 5.5,9.25 7.35,9.25 7.75,8.85 13.25,8.85 v13.85,9.45
  Bottom 0.1: v13.85,9.45 15.25,9.45 16.3,10.5 J2.13
N$83  (via drill 0.1)
  Top 0.1: U1.N3 12.3,7.7 12.25,7.75 12.25,8.3 v13.4,9.45
  Bottom 0.1: v13.4,9.45 13.4,10.15 13.75,10.5 J2.11
N$84
  Top 0.1: U1.N4 11.8,8.3 13.3,9.8 14.35,9.8 J2.12
N$85  (via drill 0.1, 0.1 layers 15-16)
  Top 0.1: U1.N5 11.2,7.6 10.85,7.95 v10.6,7.95
  Route15 0.1: v10.6,7.95 10.15,7.5 7.1,7.5 v5.65,8.95
  Bottom 0.1: v5.65,8.95 1.7,8.95 1.1,8.35 U$2.1
N$86  (via drill 0.1)
  Top 0.1: U1.N7 10.3,8.5 v9.35,9.45 | v8.05,9.9 7.8,9.9 7.7,9.8 4.35,9.8 3.65,10.5 J2.3
  Route15 0.1: v9.35,9.45 8.65,9.45 8.6,9.4 8.3,9.4 8.05,9.65 v8.05,9.9
N$87  (via drill 0.1)
  Top 0.1: U1.N9 9.3,7.9 v9.2,8
  Bottom 0.1: v9.2,8 9.2,8.3 7.7,9.8 6.9,9.8 6.2,10.5 J2.5
N$88
  Top 0.1: U1.N11 8.3,8.9 8.75,9.35 8.75,10.5 J2.7
N$131  (via drill 0.1)
  Top 0.1: v16.6,17.1 17.2,16.5 R7.2 | v16,17.7 15.4,17.7 15.1,17.4 U3.11 | v16.25,20.4 16.25,20.85 15.05,22.05 15.05,22.2 S2.T1
  Route15 0.1: v16,17.7 v16.6,17.1
  Bottom 0.1: v16.25,20.4 16.25,17.95 v16,17.7
N$132  (via drill 0.1)
  Top 0.1: S2.T2 14.4,21.95 14.8,21.55 15.25,21.55 15.95,20.85 15.95,20.15 17.2,18.9 17.2,18.75 R6.2 17.2,18.7 16.6,18.1 v16.6,17.65 | v16,17.05 15.7,16.75 15.1,16.75 U3.10
  Bottom 0.1: v16.6,17.65 v16,17.05
N$133
  Top 0.1: R5.2 13.4,22.6 13.75,22.25 S2.T3 13.8,22.2 13.8,16.9 14.6,16.1 15.05,16.1 U3.9
N$135
  Top 0.102: S2.B1 15,23.4 15,23.9 14.5,24.4 13.85,24.4 12.8,23.35 12.8,23.1 12.7,23 12.1,23 11.25,22.15 11.25,20.7 9.9,19.35 9.45,19.35 U3.3
N$136  (via drill 0.1)
  Top 0.1: v14.4,24.05 S2.B2 | v14.15,20.95 14.15,19.15 14.6,18.7 15.05,18.7 U3.13 | v10.45,20.65 9.45,20.65 U3.1
  Bottom 0.1: v14.4,24.05 14.4,21.2 v14.15,20.95 13.85,20.65 v10.45,20.65
REF  (via drill 0.1)
  Top 0.102: U1.M1 14.35,7.1 v15.2,7.95 | v1.9,3 1.9,3.95 1.65,4.2 1.65,6.8 2.35,7.5 J2.2
  Bottom 0.102: 16.4,7.95 v15.2,7.95 | 16.4,7.95 16.7,7.65 S3.6 16.75,7.1 17.1,7.1 S3.4 17.15,7.1 17.5,7.1 S3.2 | S3.75 2.7,2.15 2.35,2.15 S3.77 2.3,2.15 1.9,2.15 S3.79 v1.9,3 | 16.4,7.95 16.4,8.35 18.3,10.25 18.3,10.75 17.85,11.2 3.1,11.2 2.4,10.5 J2.2
REF_A  (via drill 0.1)
  Top 0.1: v12.05,18.7 9.45,18.7 U3.4 9.4,18.65 v8.45,18.65
  Bottom 0.1: v12.05,18.7 14.1,18.7 REF.1 | J1.2 2.65,14 7.3,18.65 v8.45,18.65
VCC  (via drill 0.1)
  Top 0.102: C1.1 1.25,18.1 1.8,17.55 2.7,17.55 3.85,18.7 3.85,19.45 C3.1 3.85,19.5 3.85,19.65 v4.5,20.3 | U2.15 2.7,27.15 3.3,27.15 U2.14 3.3,27.1 3.6,26.8 3.6,26.75 3.75,26.6 4.3,26.6 v4.4,26.7 | 7.42,22.52 S1.T6 | 7.42,22.52 v7.15,22.8 | 7.42,22.52 v7.05,22.15 | U3.16 15.1,20.65 v15.1,21.1 15.05,21 14.7,21.35 v14.1,21.35
  Bottom 0.102: v4.4,26.7 4.4,26.5 7.15,23.75 v7.15,22.8 10.05,22.8 11.5,21.35 v14.1,21.35 | v4.5,20.3 4.6,20.3 6.45,22.15 v7.05,22.15 | v15.1,21.1 15.1,21.9 16.68,23.48 | VDD.1 16.68,23.48 | 16.68,23.48 18,22.15 18,21.5 17.6,21.1 J1.14
VCC_B  (via drill 0.1 layers 1-2)
  Top 0.1: U1.N15 U1.M15 6.4,7.1 6.75,6.75 v11.5,6.75 | U1.N2 U1.M2 | v12.55,7.9 12.8,7.65 U1.N2 | 16.9,9 16.9,9.85 17.55,10.5 J2.14 | 16.9,9 16.9,8.45 | 16.9,8.45 17.55,7.8 17.55,5.15 17,4.6 R4.1 | 16.9,8.45 C4.1 | 16.9,9 14.3,9 13,7.7 12.8,7.7 U1.N2
  Route2 0.1: v11.5,6.75 11.5,6.85 v12.55,7.9
XOUT  (via drill 0.1)
  Top 0.1: U2.12 4.85,26.25 4.75,26.25 4.35,25.85 4.35,22 CX.1 5.05,21.4 v5.6,20.85 | v7.85,20.15 v8.35,19.65
  Bottom 0.1: v8.35,19.65 13.75,14.25 13.75,14 J1.11 | v7.85,20.15 6.3,20.15 v5.6,20.85
YOUT  (via drill 0.1)
  Top 0.1: v5.5,24.95 4.9,24.95 U2.10 | v3.3,22.75 2.55,22.75 1.2,21.4 CY.1
  Bottom 0.1: v3.3,22.75 5.03,24.48 | 5.03,24.48 v5.5,24.95 | 5.03,24.48 7,22.5 9.8,22.5 10.7,21.6 10.7,21.3 10.55,21.15 10.5,21.15 10.15,20.8 10.15,20.15 15.05,15.25 J1.12
ZOUT  (via drill 0.1)
  Top 0.1: v3.95,22.75 3.95,23.4 U2.8 | v1.95,20.75 1.95,20.15 1.25,19.45 CZ.1 1.2,19.45 0.7,18.95 0.7,17.65 1.05,17.3 1.05,16.2 U$1.1
  Bottom 0.1: v1.95,20.75 v3.95,22.75

### Text on the board
bPlace: 2019, Matthias Klumpp | intantech.com | v1.0